# Altium schematic sheet motor_voltage.SchDoc
size A
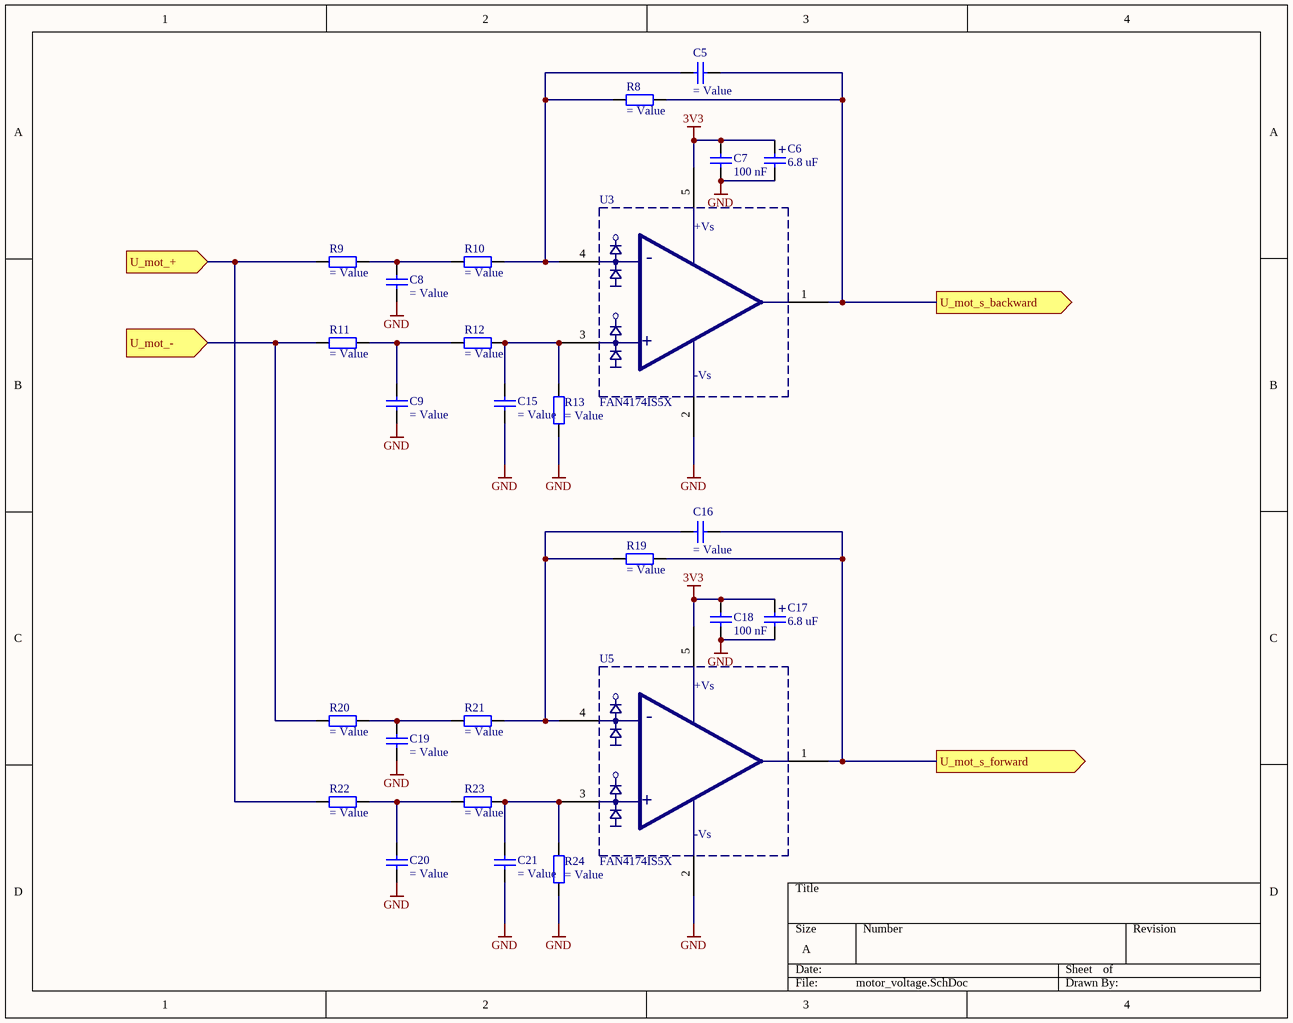
[diagram p0: motor_voltage.SchDoc]

## Parts
C5  (no value)  [0805_C]
C6  6.8 uF
C7  100 nF  [0805_C]
C8  (no value)  [0805_C]
C9  (no value)  [0805_C]
C15  (no value)  [0805_C]
C16  (no value)  [0805_C]
C17  6.8 uF
C18  100 nF  [0805_C]
C19  (no value)  [0805_C]
C20  (no value)  [0805_C]
C21  (no value)  [0805_C]
R8  (no value)
R9  (no value)
R10  (no value)
R11  (no value)
R12  (no value)
R13  (no value)
R19  (no value)
R20  (no value)
R21  (no value)
R22  (no value)
R23  (no value)
R24  (no value)
U3  FAN4174IS5X  [SOT-23-5]
U5  FAN4174IS5X  [SOT-23-5]

## Ports
U_mot_+ (in), U_mot_- (in), U_mot_s_backward (out), U_mot_s_forward (out)

## Nets
3V3: C6.2 C7.1 C17.2 C18.1 U3.5(+Vs) U5.5(+Vs)
GND: C6.1 C7.2 C8.2 C9.2 C15.2 C17.1 C18.2 C19.2 C20.2 C21.2 R13.1 R24.1 U3.2(-Vs) U5.2(-Vs)
U_mot_+: R9.1 R22.1 ; port U_mot_+
U_mot_-: R11.1 R20.1 ; port U_mot_-
U_mot_s_backward: C5.2 R8.2 U3.1(OUT) ; port U_mot_s_backward
U_mot_s_forward: C16.2 R19.2 U5.1(OUT) ; port U_mot_s_forward
NetC5_1: C5.1 R8.1 R10.2 U3.4(-IN)
NetC8_1: C8.1 R9.2 R10.1
NetC9_1: C9.1 R11.2 R12.1
NetC15_1: C15.1 R12.2 R13.2 U3.3(+IN)
NetC16_1: C16.1 R19.1 R21.2 U5.4(-IN)
NetC19_1: C19.1 R20.2 R21.1
NetC20_1: C20.1 R22.2 R23.1
NetC21_1: C21.1 R23.2 R24.2 U5.3(+IN)

## Notes on the sheet
- (in symbol CAP ELKO SMD) +
- (in symbol FAN4174IS5X) -; +

## Library data of the parts
C5 C7-C9 C15 C16 C18-C21 = CAP 0805
C6 C17 = CAP ELKO SMD: SMD Aluminium Electrolytic Capacitor, Radial Can - SMD, 6.8 µF, 35 V, WCAP-ASLI Series; ComponentLink1Description: Farnell.com; ComponentLink1URL: https://hu.farnell.com/wurth-elektronik/865080540003/cap-6-8-f-35v-smd/dp/2466312
R8-R13 R19-R24 = RES 0805
U3 U5 = FAN4174IS5X: OrderCode: 671-1166; CompType: FAN4174IS5X; Distributor: RS components; Package: SOT-23-5; ComponentLink1Description: Farnell.com; ComponentLink1URL: https://hu.farnell.com/on-semiconductor/fan4174is5x/ic-op-amp-r2r-i-o-smd/dp/1467284?st=FAN4174IS5X